# Altium schematic sheet nRF24L01.SchDoc
size 297 x 209 mm; SheetNumber: 12; SheetTotal: 12
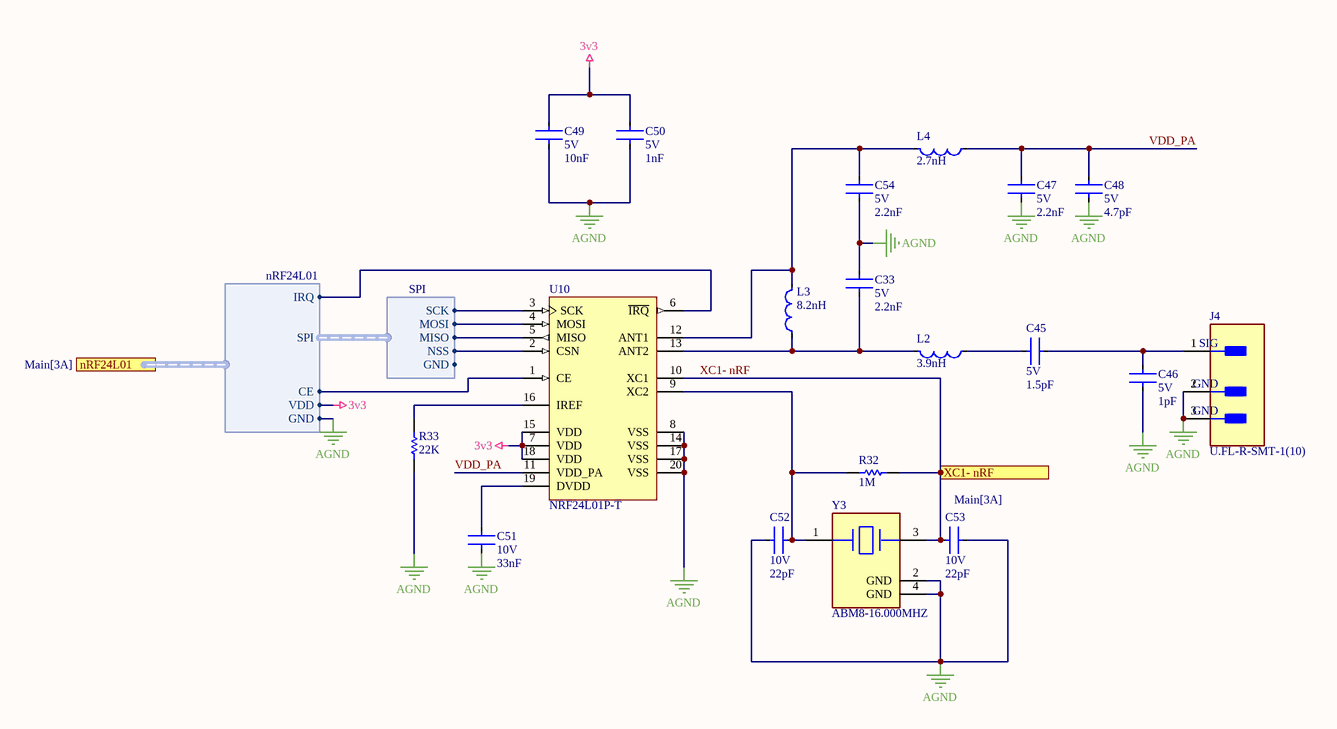
[diagram p0: nRF24L01.SchDoc]

## Parts
C33  Voltage: 5V  [CAP-0603-IPC_B]  (hidden comment: 2.2nF)
C45  Voltage: 5V  [CAP-0603-IPC_B]  (hidden comment: 1.5pF)
C46  Voltage: 5V  [CAP-0603-IPC_B]  (hidden comment: 1pF)
C47  Voltage: 5V  [CAP-0603-IPC_B]  (hidden comment: 2.2nF)
C48  Voltage: 5V  [CAP-0603-IPC_B]  (hidden comment: 4.7pF)
C49  Voltage: 5V  [CAP-0603-IPC_B]  (hidden comment: 10nF)
C50  Voltage: 5V  [CAP-0603-IPC_B]  (hidden comment: 1nF)
C51  Voltage: 10V  [CAP-0603-IPC_B]  (hidden comment: 33nF)
C52  Voltage: 10V  [CAP-0402-IPC_B]  (hidden comment: 22pF)
C53  Voltage: 10V  [CAP-0402-IPC_B]  (hidden comment: 22pF)
C54  Voltage: 5V  [CAP-0603-IPC_B]  (hidden comment: 2.2nF)
J4  U.FL-R-SMT-1(10)  [Hirose U.FL_SMT-1_10-MFG]
L2  3.9nH  [ind-0603-IPC_B]
L3  8.2nH  [ind-0603-IPC_B]
L4  2.7nH  [ind-0603-IPC_B]
R32  1M  [RES-0402-IPC_B]
R33  22K  [RES-0603-IPC_B]
U10  NRF24L01P-T  [NRSC-QFN-20_L]
Y3  ABM8-16.000MHZ  [ABM8-Xtal-MFG]

## Ports
nRF24L01 (harness nRF24L01, see Main[3A]), XC1- nRF (see Main[3A])

## Harnesses
SPI: NSS, SCK, MOSI, MISO, GND
nRF24L01: CE, IRQ, VDD, GND, SPI

## Nets
3v3: C49.1 C50.1 U10.7(VDD) U10.15(VDD) U10.18(VDD) ; port nRF24L01.VDD
AGND: C33.2 C46.1 C47.1 C48.2 C49.2 C50.2 C51.2 C52.1 C53.2 C54.1 J4.2(GND) J4.3(GND) R33.2 U10.8(VSS) U10.14(VSS) U10.17(VSS) U10.20(VSS) Y3.2(GND) Y3.4(GND) ; port nRF24L01.GND
VDD_PA: C47.2 C48.1 L4.2 U10.11(VDD_PA)
XC1- nRF: C53.1 R32.2 U10.10(XC1) Y3.3 ; port XC1- nRF
NetC33_1: C33.1 L2.1 L3.2 U10.13(ANT2)
NetC45_1: C45.1 L2.2
NetC45_2: C45.2 C46.2 J4.1(SIG)
NetC51_1: C51.1 U10.19(DVDD)
NetC52_2: C52.2 R32.1 U10.9(XC2) Y3.1
NetC54_2: C54.2 L3.1 L4.1 U10.12(ANT1)
NetR33_1: R33.1 U10.16(IREF)
NetU10_1: U10.1(CE) ; port nRF24L01.CE
NetU10_2: U10.2(CSN) ; harness SPI.NSS
NetU10_3: U10.3(SCK) ; harness SPI.SCK
NetU10_4: U10.4(MOSI) ; harness SPI.MOSI
NetU10_5: U10.5(MISO) ; harness SPI.MISO
NetU10_6: U10.6(~{IRQ}) ; port nRF24L01.IRQ

## Notes on the sheet
- Title
- Size:
- Date:
- A4
- Variant :
- Time:
- Sheet
- Revision:
- of
- Company Link :
- Designer:
- Designer Link:
- www.fatehscan.com
- File:

## Library data of the parts
C33 C45-C54 = CAP-Ceramic: Multilayer Ceramic Capacitors; ComponentLink1Description: link; ComponentLink1URL: *
  C33 C47 C54: Capacitance: 2.2nF
  C45: Capacitance: 1.5pF
  C46: Capacitance: 1pF
  C48: Capacitance: 4.7pF
  C49: Capacitance: 10nF
  C50: Capacitance: 1nF
  C51: Capacitance: 33nF
  C52 C53: Capacitance: 22pF
J4 = Hirose U.FL: CONN U.FL RCPT STR 50 OHM SMD / RF connector for high-frequency signals up to 6 GHz; Max Frequency: 6GHz; Connector Type: Coaxial; Body Plating: Silver; Body Material: Bronze; Impedance: 50R; Dielectric Material: Polymer; Insulation Resistance: 500MR; Gender: Male; Packaging: Cut Tape; Length: 3mm; Package Quantity: 2500; Termination: Solder; Lead Free: Lead Free; Series: U.FL; Min Operating Temperature: -40°C; Fastening Type: Snap; Contact Material: Brass; Orientation: Straight; Wire/Cable Type: Coaxial; Frequency: 6GHz; Contact Plating: Gold; Depth: 3.1mm; Weight: 0.001764oz; Max Operating Temperature: 90°C; Radiation Hardening: No; REACH SVHC: No SVHC; Mount: Surface Mount; Housing Color: Beige
L2-L4 = inductor: DC Current: 900mA; Core Material: Air; Case/Package: 0402
  L2: Value: 3.9nH
  L3: Value: 8.2nH
  L4: Value: 2.7nH
R32 R33 = RES_SMD: Chip Resistor; Voltage Rating: 75 V; PackageReference: =Footprints; ComponentLink2Description: Datasheet; ComponentLink2URL: http://www.vishay.com/docs/20035/dcrcwe3.pdf
  R32: value: 1M
  R33: value: 22K
U10 = CMP-2000-06859-1: Single Chip Transceiver, 2.4 GHz, 60 mW, 1.9 to 3.6 V, -40 to 85 degC, 20-Pin QFN, RoHS, Tray; Manufacturer: Nordic Semiconductor; Data Rate (Max): 2Mbps; Current - Transmitting: 7mA~11.3mA; Power - Output: 0dBm; Other Names: 1490-1019; Online Catalog: nRF24L01+; Current - Receiving: 12.6mA~13.5mA; For Use With: 1490-1002-ND-KITEVALUATIONNRF24L01P1568-1295-ND-SPARKFUNTRANSCEIVERBREAKOUT-1568-1296-ND-SPARKFUNTRANSCEIVERBREAKOUT-1471-1410-ND-DEVBOARDNRFSCLICKNRF24L01P-MODULE-PCB-ND-KITEVALNRF24L01+PCBANTENNANRF24L01P-MODULE-SMA-ND-KITEVALNRF24L01+SMACONNNRF24L01P-UPGRADE-ND-UPGRADE2PCB/1SMANRF24L01103990038-ND-DEVDUINOSENSORNODEV1.3103990053-ND-DEVDUINOSENSORNODEV2(ATMEGA103990074-ND-DEVDUINOSENSORNODE106990026-ND-ENERGYMONITORSHIELDV2113990088-ND-WIRELESSGATESHIELD113990095-ND-DEVDUINOSENSORNODEV3(ATMEGA106030001-ND-ENERGYMONITORSHIELD1597-1361-ND-DEVDUINOSENSORNODEV2.2(ATMEG105990030-ND-RGBWSTRIPWIRELESSSHIELDV1.0; Frequency: 2.4GHz; Design Resources: DevelopmentToolSelector; RF Family/Standard: GeneralISM>1GHZ; Serial Interfaces: SPI; Sensitivity: -94dBm; Voltage - Supply: 1.9V~3.6V; Modulation: GFSK; GPIO: -; Package Reference: QFN20; Memory Size: -; Category: RF/IFandRFID; Type: TxRxOnly; Standard Package: 490; Package / Case: 20-VFQFNExposedPad; Packaging: Tray; Series: -; Package Description: 20-Pin Quad Flat No-lead Package, Body 4 x 4 mm, Pitch 0.5 mm; Datasheet Version: Rev. 1.0, 09/2008; Protocol: -; Manufacturer URL: http://www.nordicsemi.com/eng/Products/; Operating Temperature: -40°C~85°C; Family: RFTransceiverICs; Datasheet URL: http://www.nordicsemi.com/eng/content/download/2726/34069/file/nRF24L01P_Product_Specification_1_0.pdf; Mounting Technology: SurfaceMount
Y3 = Crystal: Crystal 16MHz ±10ppm 7pF SMD-4 3.2mm x 2.5mm; Series Resistance: 70R; Frequency Tolerance: 10ppm; Min Operating Temperature: -10°C; Load Capacitance: 7pF; Height: 0.031inch; Lead Free: Lead Free; Max Operating Temperature: 60°C; Radiation Hardening: No; Frequency: 16MHz; ESR (Equivalent Series Resistance): 70R; Case/Package: SMD/SMT; Mount: Surface Mount; Number of Pins: 4; RoHS Compliant: Yes; Length: 0.126inch; Packaging: Tape and Reel; Width: 0.098inch; Frequency Stability: 10ppm